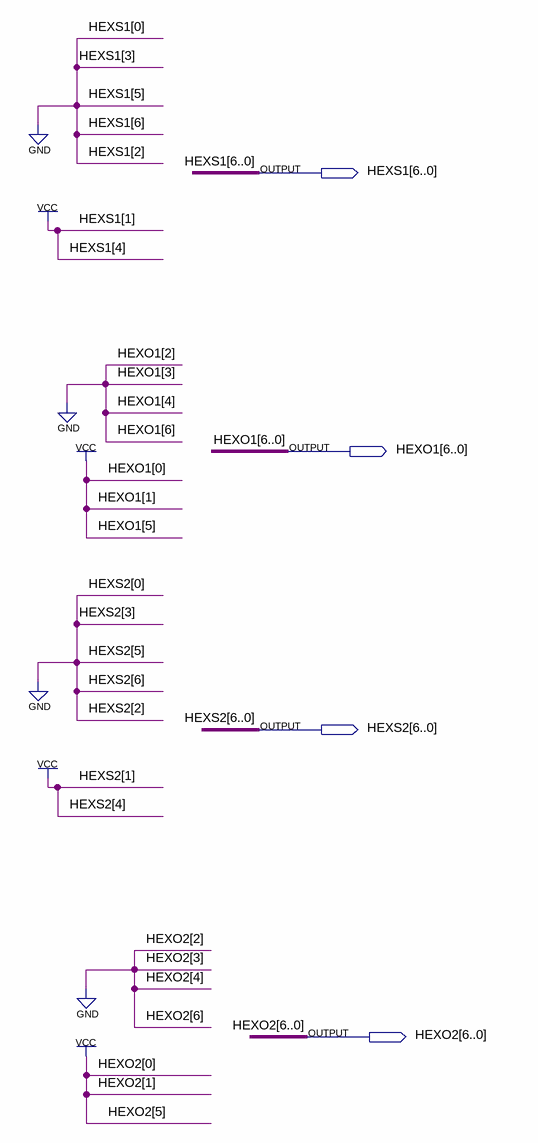
[diagram p0: schematic sheet]
// Quartus schematic Soso.bdf as structural Verilog: 0 symbols, 4 pins
module Soso (
  output [6:0] HEXS1,
  output [6:0] HEXO1,
  output [6:0] HEXS2,
  output [6:0] HEXO2
);


  assign HEXO1 = 7'b0100011;
  assign HEXO2 = 7'b0100011;
  assign HEXS1 = 7'b0010010;
  assign HEXS2 = 7'b0010010;
endmodule
